# Altium schematic sheet TLV75533PDRVR.SchDoc
size A4; SheetNumber: 7; SheetTotal: 14
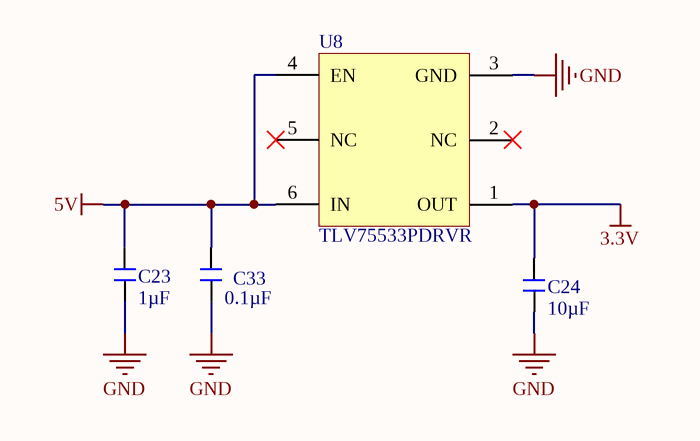
[diagram p0: TLV75533PDRVR.SchDoc]

## Parts
C23  value 1µF  [402 capacitor - duplicate]  (hidden comment: 0402 capacitor)
C24  value 10µF  [603 CAPACITOR]  (hidden comment: 0603 CAPACİTOR)
C33  value 0.1µF  [402 capacitor - duplicate]  (hidden comment: 0402 capacitor)
U8  TLV75533PDRVR  [TLV75533PDRVR]

## Nets
3.3V: C24.2 U8.1(OUT)
5V: C23.2 C33.2 U8.4(EN) U8.6(IN)
GND: C23.1 C24.1 C33.1 U8.3(GND)

Not connected (* = marked no-connect by the designer): U8 2(NC)* 5(NC)*

## Library data of the parts
C23 = CAP SMD 402: MPN: GRM155R6YA105KE11D; Package: 0402
C24 = CON SMD 0603: MPN: GRM188R61E106MA73D; Pacage: 0603
C33 = CAP SMD 402: MPN: CL05A104KA5NNNC; Package: 0402
U8 = TLV75533PDRVR: IC REG LINEAR 3.3V 500MA 6-WSON; MPN: TLV75533PDRVR